# EAGLE schematic badge (EAGLE 8.7.0)
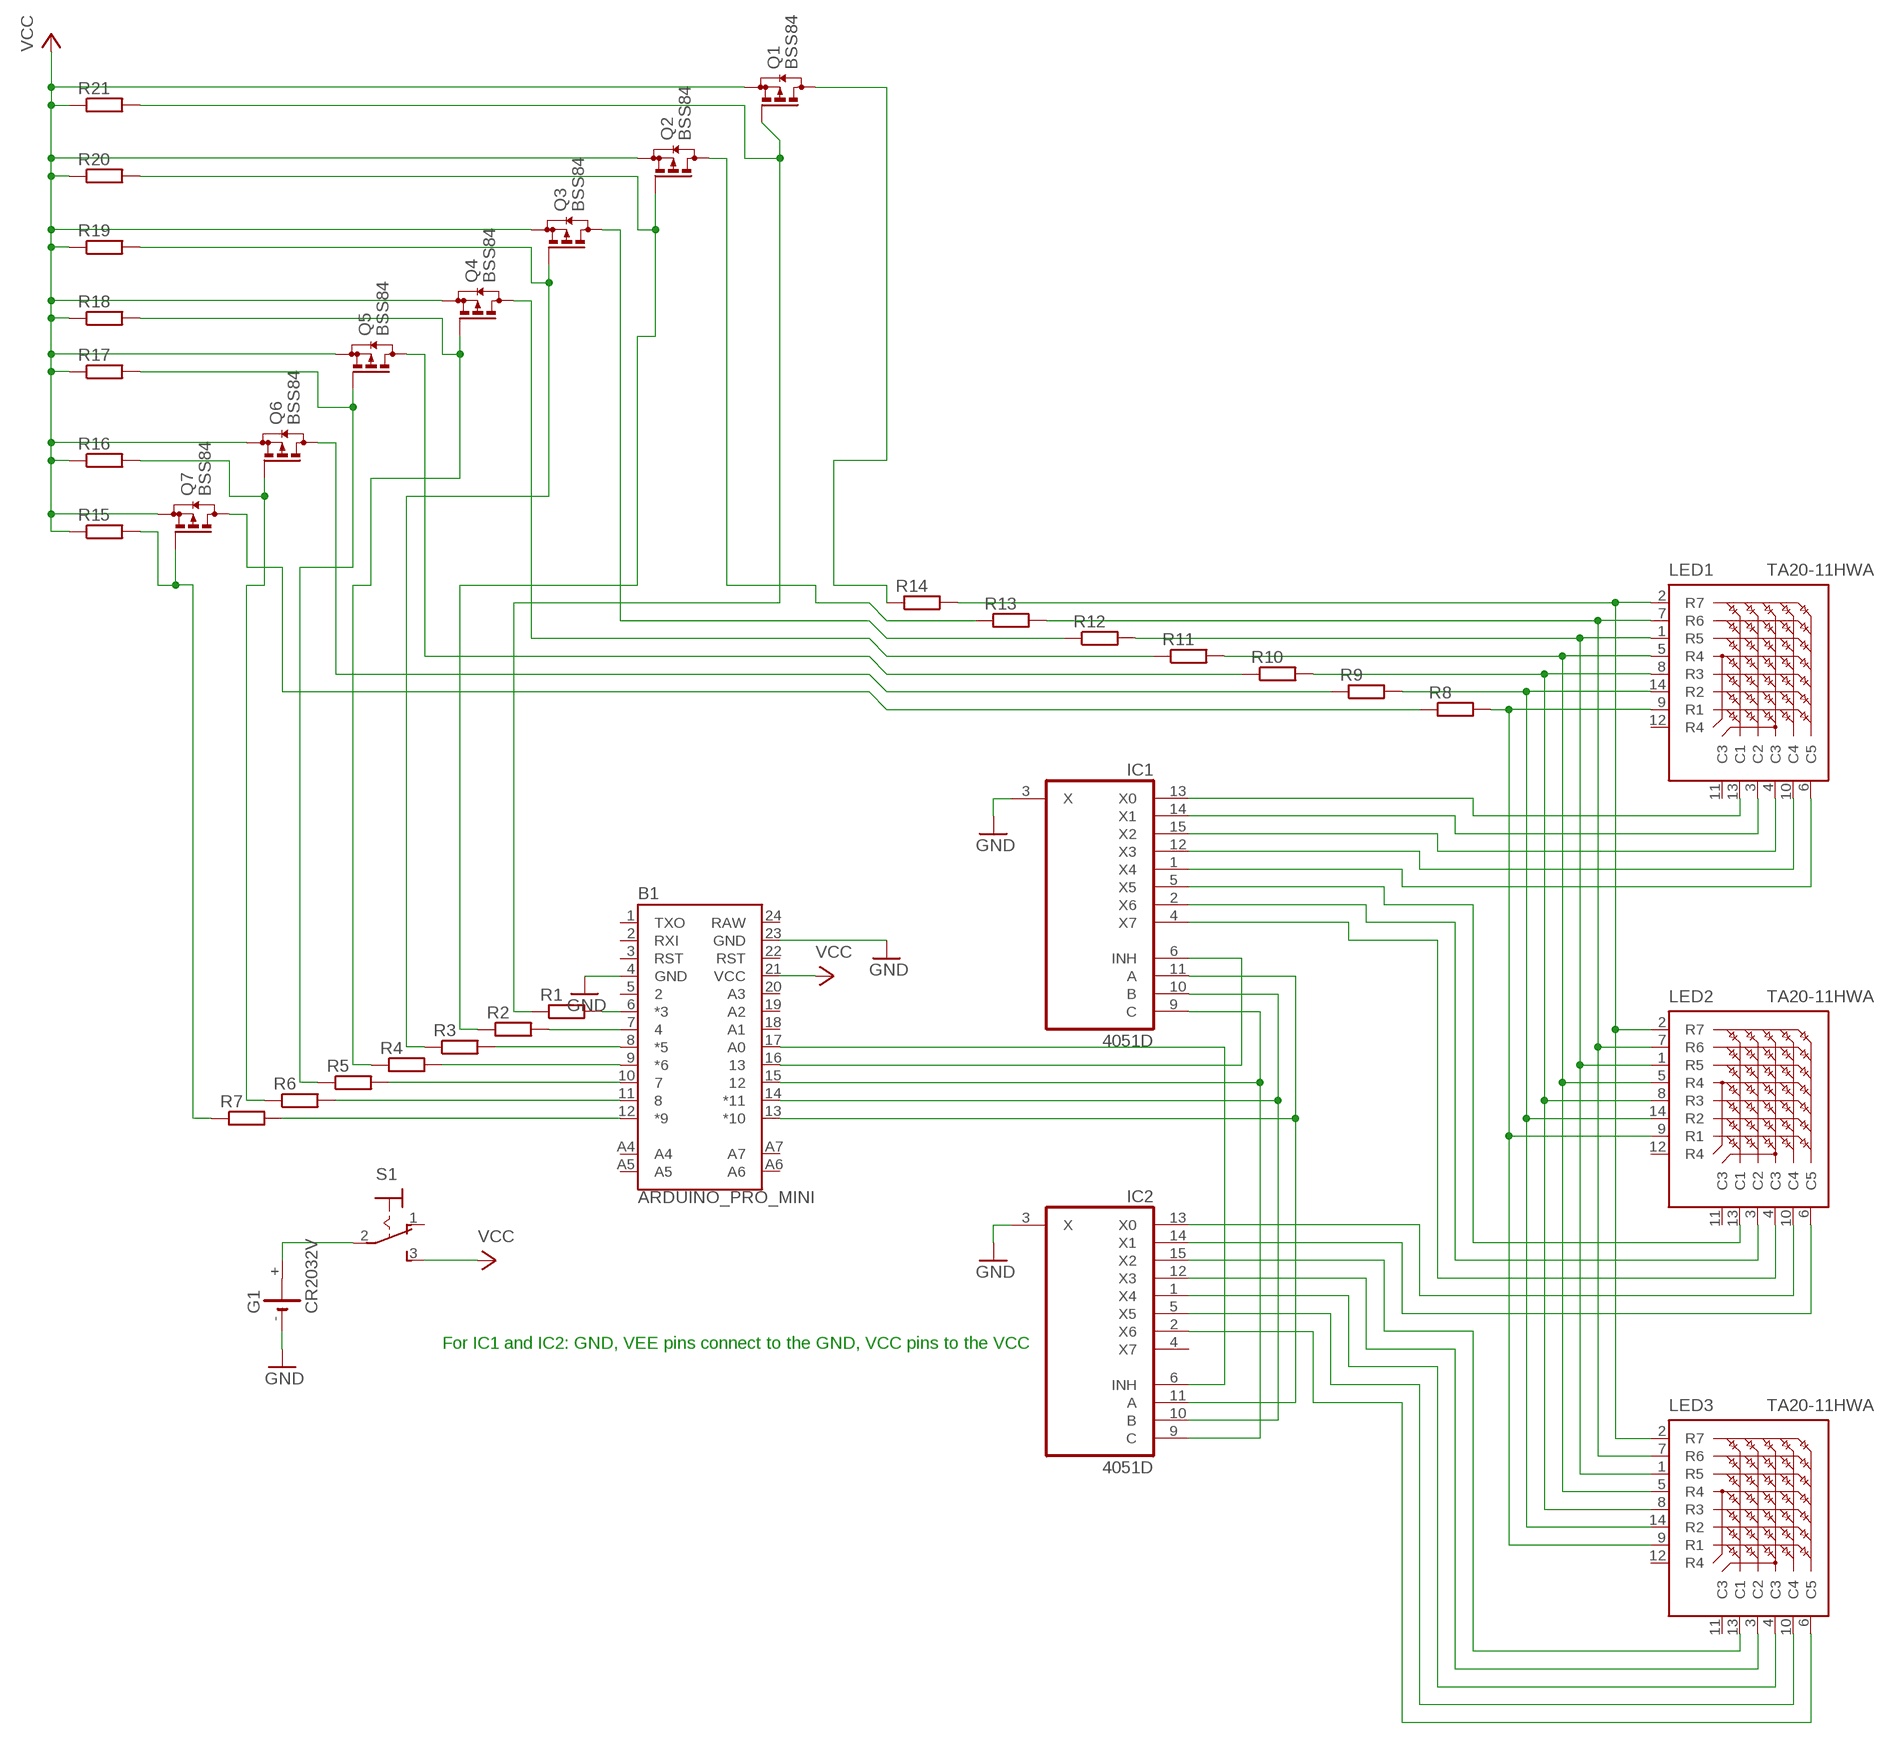
[diagram p0: schematic, sheet 1]

## Parts
B1  ARDUINO_PRO_MINI  [ARDUINO_PRO_MINI]
G1  CR2032V  [CR2032V]
IC1  4051D  [SO16]
IC2  4051D  [SO16]
LED1  TA20-11HWA  [TA20-11HWA]
LED2  TA20-11HWA  [TA20-11HWA]
LED3  TA20-11HWA  [TA20-11HWA]
Q1  BSS84  [SOT23]
Q2  BSS84  [SOT23]
Q3  BSS84  [SOT23]
Q4  BSS84  [SOT23]
Q5  BSS84  [SOT23]
Q6  BSS84  [SOT23]
Q7  BSS84  [SOT23]
R1  R-EU_R0603  [R0603]
R2  R-EU_R0603  [R0603]
R3  R-EU_R0603  [R0603]
R4  R-EU_R0603  [R0603]
R5  R-EU_R0603  [R0603]
R6  R-EU_R0603  [R0603]
R7  R-EU_R0603  [R0603]
R8  R-EU_R0805  [R0805]
R9  R-EU_R0805  [R0805]
R10  R-EU_R0805  [R0805]
R11  R-EU_R0805  [R0805]
R12  R-EU_R0805  [R0805]
R13  R-EU_R0805  [R0805]
R14  R-EU_R0805  [R0805]
R15  R-EU_R0603  [R0603]
R16  R-EU_R0603  [R0603]
R17  R-EU_R0603  [R0603]
R18  R-EU_R0603  [R0603]
R19  R-EU_R0603  [R0603]
R20  R-EU_R0603  [R0603]
R21  R-EU_R0603  [R0603]
S1  320-916  [320-916]

## Nets
GND: B1.4(GND) B1.23(GND) G1.- IC1.3(X) IC2.3(X)
N$1: LED1.2(R7) LED2.2(R7) LED3.2(R7) R14.2
N$2: LED1.7(R6) LED2.7(R6) LED3.7(R6) R13.2
N$3: LED1.1(R5) LED2.1(R5) LED3.1(R5) R12.2
N$4: LED1.5(R4) LED2.5(R4) LED3.5(R4) R11.2
N$5: LED1.8(R3) LED2.8(R3) LED3.8(R3) R10.2
N$6: LED1.14(R2) LED2.14(R2) LED3.14(R2) R9.2
N$7: LED1.9(R1) LED2.9(R1) LED3.9(R1) R8.2
N$8: B1.13(*10) IC1.11(A) IC2.11(A)
N$9: IC1.13(X0) LED1.13(C1)
N$10: IC1.14(X1) LED1.3(C2)
N$11: IC1.15(X2) LED1.4(C3)
N$12: IC1.12(X3) LED1.10(C4)
N$13: IC1.1(X4) LED1.6(C5)
N$14: IC1.5(X5) LED2.13(C1)
N$15: IC1.2(X6) LED2.3(C2)
N$16: IC1.4(X7) LED2.4(C3)
N$17: IC2.13(X0) LED2.10(C4)
N$18: IC2.14(X1) LED2.6(C5)
N$19: IC2.15(X2) LED3.13(C1)
N$20: IC2.12(X3) LED3.3(C2)
N$21: IC2.1(X4) LED3.4(C3)
N$22: IC2.5(X5) LED3.10(C4)
N$23: IC2.2(X6) LED3.6(C5)
N$24: B1.6(*3) R1.2
N$25: B1.7 R2.2
N$26: B1.8(*5) R3.2
N$27: B1.9(*6) R4.2
N$28: B1.10 R5.2
N$29: B1.11 R6.2
N$30: B1.12(*9) R7.2
N$31: B1.16 IC1.6(INH)
N$32: B1.17(A0) IC2.6(INH)
N$33: G1.+ S1.2(P)
N$34: Q7.1(G) R7.1 R15.2
N$35: Q6.1(G) R6.1 R16.2
N$36: B1.14(*11) IC1.10(B) IC2.10(B)
N$37: B1.15 IC1.9(C) IC2.9(C)
N$38: Q5.1(G) R5.1 R17.2
N$39: Q3.1(G) R3.1 R19.2
N$40: Q4.1(G) R4.1 R18.2
N$41: Q2.1(G) R2.1 R20.2
N$42: Q1.1(G) R1.1 R21.2
N$43: Q3.3(D) R12.1
N$44: Q7.3(D) R8.1
N$45: Q6.3(D) R9.1
N$46: Q5.3(D) R10.1
N$47: Q4.3(D) R11.1
N$48: Q2.3(D) R13.1
N$49: Q1.3(D) R14.1
VCC: B1.21(VCC) Q1.2(S) Q2.2(S) Q3.2(S) Q4.2(S) Q5.2(S) Q6.2(S) Q7.2(S) R15.1 R16.1 R17.1 R18.1 R19.1 R20.1 R21.1 S1.3(S)
Unconnected: B1.1(TXO) B1.2(RXI) B1.3(RST) B1.5 B1.18(A1) B1.19(A2) B1.20(A3) B1.22(RST) B1.A4 B1.A5 B1.A6 B1.A7 G1.+@1(+) IC2.4(X7) LED1.11(C3) LED1.12(R4) LED2.11(C3) LED2.12(R4) LED3.11(C3) LED3.12(R4) S1.1(O)

## Notes on the sheet
- For IC1 and IC2: GND, VEE pins connect to the GND, VCC pins to the VCC

## Power pins joined to a net without a drawn wire
GND: IC1.8(GND) IC2.8(GND)
RAW: B1.24(RAW)
VCC: IC1.16(VCC) IC2.16(VCC)
VEE: IC1.7(VEE) IC2.7(VEE)

## Library data of the parts
B1 = SparkFun-Boards:ARDUINO_PRO_MINI: SparkFun Pro Mini Pro Mini compatible footprint. Dimensions: 0.7 x 1.3" PCB Thickness: 0.8mm SparkFun Products: 3.3V/8MHz <https://www.sparkfun.com/products/11114> 5V/16MHz <https://www.sparkfun.com/products/11113>
G1 = battery:CR2032V: LI BATTERY Varta
IC1 IC2 = 40xx:4051: 8-channel ANALOG MULTIPLEXER
LED1-LED3 = display-kingbright:TA20-11HWA: 50mm (2.0 INCH) 5x7 DOT MATRIX DISPLAY Source: http://www.kingbright.com/manager/upload/pdf/TC20-11EWA(Ver1189410378.9); OC_FARNELL: unknown; OC_NEWARK: unknown
Q1-Q7 = transistor-small-signal:BSS84: P-CHANNEL MOS FET
R1-R7 = rcl:R-EU_: RESISTOR, European symbol; SPICEPREFIX: R
R8-R21 = resistor:R-EU_: RESISTOR, European symbol
S1 = switch:320-916: TOGGLE SWITCH distributor RS Components